# Altium schematic sheet ElectronicLoad.SchDoc
size B; SheetNumber: 1; SheetTotal: 1
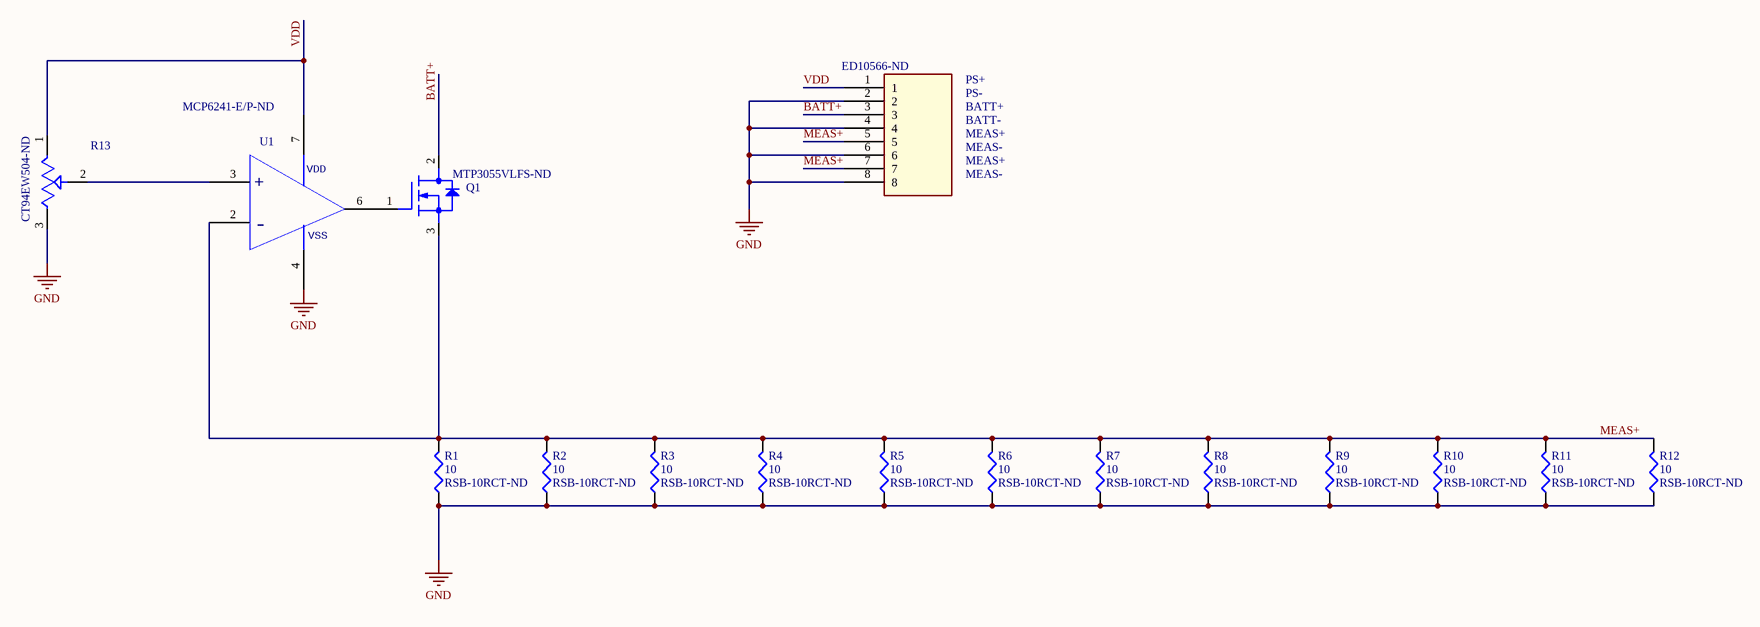
[diagram p0: ElectronicLoad.SchDoc]

## Parts
J1  Supplier Part Number 1: ED10566-ND  [CONN8_8X100]  (hidden comment: CONN8)
Q1  Supplier Part Number 1: MTP3055VLFS-ND  [TO-220-3]  (hidden comment: MTP3055VL)
R1  value 10  Supplier Part Number 1: RSB-10RCT-ND  [R_ThruHole_3W]  (hidden comment: Res3)
R2  value 10  Supplier Part Number 1: RSB-10RCT-ND  [R_ThruHole_3W]  (hidden comment: Res3)
R3  value 10  Supplier Part Number 1: RSB-10RCT-ND  [R_ThruHole_3W]  (hidden comment: Res3)
R4  value 10  Supplier Part Number 1: RSB-10RCT-ND  [R_ThruHole_3W]  (hidden comment: Res3)
R5  value 10  Supplier Part Number 1: RSB-10RCT-ND  [R_ThruHole_3W]  (hidden comment: Res3)
R6  value 10  Supplier Part Number 1: RSB-10RCT-ND  [R_ThruHole_3W]  (hidden comment: Res3)
R7  value 10  Supplier Part Number 1: RSB-10RCT-ND  [R_ThruHole_3W]  (hidden comment: Res3)
R8  value 10  Supplier Part Number 1: RSB-10RCT-ND  [R_ThruHole_3W]  (hidden comment: Res3)
R9  value 10  Supplier Part Number 1: RSB-10RCT-ND  [R_ThruHole_3W]  (hidden comment: Res3)
R10  value 10  Supplier Part Number 1: RSB-10RCT-ND  [R_ThruHole_3W]  (hidden comment: Res3)
R11  value 10  Supplier Part Number 1: RSB-10RCT-ND  [R_ThruHole_3W]  (hidden comment: Res3)
R12  value 10  Supplier Part Number 1: RSB-10RCT-ND  [R_ThruHole_3W]  (hidden comment: Res3)
R13  Supplier Part Number 1: CT94EW504-ND  [VR5]  (hidden comment: Potentiometer)
U1  Supplier Part Number 1: MCP6241-E/P-ND  [DIP8]  (hidden comment: MCP6241)

## Nets
GND: J1.2 J1.4 J1.6 J1.8 R1.1 R2.1 R3.1 R4.1 R5.1 R6.1 R7.1 R8.1 R9.1 R10.1 R11.1 R12.1 R13.3 U1.4(VEE)
BATT+: J1.3 Q1.2(DRAIN)
MEAS+: J1.5 J1.7 Q1.3(SOURCE) R1.2 R2.2 R3.2 R4.2 R5.2 R6.2 R7.2 R8.2 R9.2 R10.2 R11.2 R12.2 U1.2(IN-)
VDD: J1.1 R13.1 U1.7(VCC)
NetQ1_1: Q1.1(GATE) U1.6(VOUT)
NetR13_2: R13.2 U1.3(IN+)

## Notes on the sheet
- PS+
- PS-
- BATT+
- BATT-
- MEAS+
- MEAS-
- (in symbol MCP6241) VDD; +; -; VSS

## Library data of the parts
J1 = CONN8: Conn Terminal Block 8 POS 2.54mm Solder ST Thru-Hole 6A; Manufacturer: On-Shore Technology; Manufacturer Part Number: OSTVN08A150; Plating: Brass,Steel; Number of Levels: 1; Number of Positions Per Level: 8; Voltage: 125V; Wire Gauge (Max): 30AWG; Wire Gauge (Min): 20AWG; Pitch: 0.1inch; Supplier 1: Digi-Key; RoHS: Yes; Category: Terminal Blocks; Stock 1: 13852; Pricing 1: 1=2.48000, 10=1.87500, 25=1.73800, 50=1.56280, 100=1.52460, 250=1.33404, 500=1.21968, 1000=1.10534, 5000=1.01640 (USD); Mount: Through Hole; Number of Pins: 8; Color: Green; Contact Plating: Brass; Housing Material: Thermoplastic; Min Operating Temperature: -30°C; Max Operating Temperature: 105°C; Packaging: Bulk; Current: 6A; Termination: Screw; Series: OSTVN; RoHS Compliant: Yes; ComponentLink1URL: https://datasheet.ciiva.com/826/ostvnxxa150-826065.pdf?src-supplier=Digi-Key; ComponentLink1Description: https://datasheet.ciiva.com/826/ostvnxxa150-826065.pdf?src-supplier=Digi-Key
Q1 = MTP3055VL: Transistor MOSFET N Channel 60 Volt 12 Amp 3 Pin TO-220-3; Manufacturer: ON Semiconductor / Fairchild; CLASS: IC; Continuous Drain Current (ID): 12A; Rise Time: 190ns; Gate to Source Voltage (Vgs): 15V; Drain to Source Breakdown Voltage: 60V; Fall Time: 90ns; Power Dissipation: 48W; Drain to Source Resistance: 180mR; Turn-Off Delay Time: 30ns; Element Configuration: Single; Input Capacitance: 570pF; Number of Elements: 1; Threshold Voltage: 1.6V; Turn-On Delay Time: 20ns; Supplier 1: Digi-Key; Manufacturer Part Number: MTP3055VL; RoHS: Yes; Category: MOSFETs; Stock 1: 558; Pricing 1: 1=1.55000, 10=1.38200, 100=1.07730, 500=0.88992, 1000=0.74515 (USD); Mount: Through Hole; Case/Package: TO-220AB; Number of Pins: 3; Weight: 1.8g; Min Operating Temperature: -55°C; Max Operating Temperature: 175°C; Packaging: Rail/Tube; Package Quantity: 50; Rds On Max: 180mR; Max Power Dissipation: 48W; Drain to Source Voltage (Vdss): 60V; Voltage Rating (DC): 60V; Current Rating: 12A; Nominal Vgs: 15V; On-State Resistance: 180mR; Length: 10.67mm; Width: 4.83mm; Height: 16.51mm; RoHS Compliant: Yes; Lead Free: Lead Free; REACH SVHC: No SVHC; ComponentLink1URL: https://datasheet.ciiva.com/22681/661064-22681921.pdf?src-supplier=Element14; ComponentLink1Description: https://datasheet.ciiva.com/22681/661064-22681921.pdf?src-supplier=Element14; ComponentLink2URL: https://datasheet.ciiva.com/4444/mtp3055vl-116369-4444450.pdf?src-supplier=Mouser; ComponentLink2Description: https://datasheet.ciiva.com/4444/mtp3055vl-116369-4444450.pdf?src-supplier=Mouser; ComponentLink3URL: https://datasheet.ciiva.com/25625/0900766b810e259a-25625324.pdf?src-supplier=RSComponents; ComponentLink3Description: https://datasheet.ciiva.com/25625/0900766b810e259a-25625324.pdf?src-supplier=RSComponents; ComponentLink4URL: https://datasheet.ciiva.com/19459/873602-19459514.pdf?src-supplier=Jameco; ComponentLink4Description: https://datasheet.ciiva.com/19459/873602-19459514.pdf?src-supplier=Jameco; ComponentLink5URL: https://datasheet.ciiva.com/956/mtp3055vl-d-956226.pdf?src-supplier=Digi-Key; ComponentLink5Description: https://datasheet.ciiva.com/956/mtp3055vl-d-956226.pdf?src-supplier=Digi-Key; ComponentLink6URL: https://datasheet.ciiva.com/26791/mtp3055vl-26791705.pdf?src-supplier=IIIC; ComponentLink6Description: https://datasheet.ciiva.com/26791/mtp3055vl-26791705.pdf?src-supplier=IIIC; ComponentLink7URL: https://datasheet.ciiva.com/8114/mtp3055vl-8114732.pdf?src-supplier=Avnet; ComponentLink7Description: https://datasheet.ciiva.com/8114/mtp3055vl-8114732.pdf?src-supplier=Avnet; ComponentLink8URL: https://datasheet.ciiva.com/16956/mtp3055vl-16956647.pdf?src-supplier=Future+Electronics; ComponentLink8Description: https://datasheet.ciiva.com/16956/mtp3055vl-16956647.pdf?src-supplier=Future+Electronics; ComponentLink9URL: https://datasheet.ciiva.com/26143/mtp3055vl-26143884.pdf?src-supplier=Avnet+Europe; ComponentLink9Description: https://datasheet.ciiva.com/26143/mtp3055vl-26143884.pdf?src-supplier=Avnet+Europe; ComponentLink10URL: https://datasheet.ciiva.com/48715/001264952-da-01-en-mosfet-n-ch-60v-1-mtp3055vl-to-220-3-fsc-48715526.pdf?src-supplier=Conrad; ComponentLink10Description: https://datasheet.ciiva.com/48715/001264952-da-01-en-mosfet-n-ch-60v-1-mtp3055vl-to-220-3-fsc-48715526.pdf?src-supplier=Conrad
R1-R12 = Res3: Res Wirewound 10 Ohm 1% 3W ±20ppm/°C Ceramic Hi Temp Sil AXL Thru-Hole T/R; Manufacturer: Vishay Dale; Manufacturer Part Number: RS02B10R00FE70; Resistance: 10R; Voltage Rating (DC): 5.48V; Lead Diameter: 0.81mm; Lead Length: 38.1mm; Published: 8-Jun-2000; LatestRevisionDate: 29-May-2009; LatestRevisionNote: IPC-7351 Footprint Added.; PackageReference: J1-0603; Publisher: Altium Limited; PackageDescription: Chip Resistor; Supplier 1: Digi-Key; RoHS: Yes; Category: Through-Hole Resistors; Stock 1: 3839; Pricing 1: 1=1.34000, 10=1.18400, 25=1.08880, 50=0.99320, 100=0.85950, 250=0.72580, 500=0.61120 (USD); Case/Package: Ceramic; Number of Pins: 2; Contact Plating: Tin,Matte; Min Operating Temperature: -65°C; Max Operating Temperature: 250°C; Package Quantity: 1; Tolerance: 1%; Power Rating: 3W; Packaging: Tape and Reel; Resistor Type: Wirewound; Termination: Axial; Number of Terminations: 2; Temperature Coefficient: 20ppm/°C; Max Power Dissipation: 3W; Features: Moisture Resistant; Series: RS; Construction: Cylindrical; Resistance Tolerance: 1%; Diameter: 4.75mm; Length: 15.8mm; Width: 4.75mm; Radiation Hardening: No; REACH SVHC: Unknown; Military Standard: Not; Lead Free: Lead Free; RoHS Compliant: Yes; ComponentLink1URL: https://datasheet.ciiva.com/3260/rsns-3260765.pdf?src-supplier=Avnet; ComponentLink1Description: https://datasheet.ciiva.com/3260/rsns-3260765.pdf?src-supplier=Avnet; ComponentLink2URL: https://datasheet.ciiva.com/8790/rsns-8790701.pdf?src-supplier=Avnet; ComponentLink2Description: https://datasheet.ciiva.com/8790/rsns-8790701.pdf?src-supplier=Avnet; ComponentLink3URL: https://datasheet.ciiva.com/2716/rsns-2716118.pdf?src-supplier=Digi-Key; ComponentLink3Description: https://datasheet.ciiva.com/2716/rsns-2716118.pdf?src-supplier=Digi-Key; ComponentLink4URL: https://datasheet.ciiva.com/2716/rsns-2716119.pdf?src-supplier=Digi-Key; ComponentLink4Description: https://datasheet.ciiva.com/2716/rsns-2716119.pdf?src-supplier=Digi-Key; ComponentLink5URL: https://datasheet.ciiva.com/16377/rsns-16377193.pdf?src-supplier=Future+Electronics; ComponentLink5Description: https://datasheet.ciiva.com/16377/rsns-16377193.pdf?src-supplier=Future+Electronics; ComponentLink6URL: https://datasheet.ciiva.com/7734/rsns-7734117.pdf?src-supplier=Element14; ComponentLink6Description: https://datasheet.ciiva.com/7734/rsns-7734117.pdf?src-supplier=Element14
R13 = Potentiometer: Res Cermet Trimmer 500K Ohm 10% 1/2W 15(Elec)/18(Mech)Turn 2.3mm (9.6 X 4.8 X 10.7mm) Pin Thru-Hole Bulk; Manufacturer: Nidec Copal; Manufacturer Part Number: CT-94EW504; MP: 2-1625931-5; MF: TE Connectivity; Resistance: 500kR; Number of Turns: 18; Max Power Dissipation: 500mW; Temperature Coefficient: 100ppm/°C; TE_purchase_URL: https://www.te.com/usa-en/product-2-1625931-5.html?te_bu=Cor&te_type=disp&te_campaign=seda_glo_cor-seda-global-disp-prtnr-fy19-seda-model-bom-cta_sma-317_1&elqCampaignId=32493; Package: None; Value: *; Price: None; Availability: Unavailable; SnapEDA_Link: https://www.snapeda.com/parts/2-1625931-5/TE%20Connectivity%20Passive%20Product/view-part/210283/?ref=snap; Supplier 1: Digi-Key; RoHS: Yes; Category: Variable Resistors and Potentiometers; Stock 1: 1213; Pricing 1: 1=1.55000, 10=1.36400, 25=1.22720, 50=1.18160, 100=1.13620, 250=1.06808, 500=0.90900, 1000=0.84082, 5000=0.69084 (USD); Mount: Through Hole; Color: Blue; Weight: 920mg; Contact Plating: Tin; Min Operating Temperature: -55°C; Max Operating Temperature: 125°C; Tolerance: 10%; Packaging: Bulk; Package Quantity: 50; Resistor Type: Cermet; Termination: PC Pin; Series: CT94; Length: 0.378inch; Width: 0.189inch; Height: 0.378inch; Lead Free: Lead Free; ComponentLink1URL: https://datasheet.ciiva.com/2161/ct-94-2161937.pdf?src-supplier=Digi-Key; ComponentLink1Description: https://datasheet.ciiva.com/2161/ct-94-2161937.pdf?src-supplier=Digi-Key
U1 = MCP6241: IC, Op Amp, Operating Voltage, 1.8 - 5.5V, Outputs, 1, GBWP, 550kHz, PDIP-8; Manufacturer: Microchip; Manufacturer Part Number: MCP6241-E/P; Common Mode Rejection Ratio: 60dB; Min Supply Voltage: 1.8V; Voltage Gain: 110dB; Slew Rate: 0.3V/µs; Bandwidth: 650kHz; Number of Channels: 1; Output Current: 23mA; Nominal Supply Current: 50uA; Input Offset Voltage (Vos): 5mV; Input Bias Current: 1pA; Amplifier Type: GENERAL PURPOSE; Max Frequency: 1kHz; Supplier 1: Digi-Key; RoHS: Yes; Category: Amplifiers - Op Amps, Buffer, Instrumentation; Stock 1: 1246; Pricing 1: 1=0.39000, 25=0.32880, 100=0.30000 (USD); Mount: Through Hole; Case/Package: PDIP; Number of Pins: 8; Min Operating Temperature: -40°C; Max Operating Temperature: 125°C; Max Supply Voltage: 5.5V; Gain Bandwidth Product: 550kHz; Unity Gain Bandwidth Product: 550kHz; Packaging: Rail/Tube; Package Quantity: 60; Number of Circuits: 1; Number of Elements: 1; Number of Amplifiers: 1; Supply Current: 50uA; Technology: CMOS; Max Input Voltage: 5.5V; Min Input Voltage: 1.8V; Length: 10.16mm; Width: 0.28inch; Height: 0.195inch; Radiation Hardening: No; REACH SVHC: No SVHC; Lead Free: Lead Free; RoHS Compliant: Yes; ComponentLink1URL: https://datasheet.ciiva.com/1804/21882d-1804785.pdf?src-supplier=Digi-Key; ComponentLink1Description: https://datasheet.ciiva.com/1804/21882d-1804785.pdf?src-supplier=Digi-Key; ComponentLink2URL: https://datasheet.ciiva.com/11710/jp019941-11710197.pdf?src-supplier=Avnet; ComponentLink2Description: https://datasheet.ciiva.com/11710/jp019941-11710197.pdf?src-supplier=Avnet; ComponentLink3URL: https://datasheet.ciiva.com/8078/630314-8078893.pdf?src-supplier=Element14; ComponentLink3Description: https://datasheet.ciiva.com/8078/630314-8078893.pdf?src-supplier=Element14; ComponentLink4URL: https://datasheet.ciiva.com/16756/jp019941-16756015.pdf?src-supplier=Avnet+Europe; ComponentLink4Description: https://datasheet.ciiva.com/16756/jp019941-16756015.pdf?src-supplier=Avnet+Europe; ComponentLink5URL: https://datasheet.ciiva.com/14545/70048229-14545020.pdf?src-supplier=Allied+Electronics; ComponentLink5Description: https://datasheet.ciiva.com/14545/70048229-14545020.pdf?src-supplier=Allied+Electronics